# EAGLE schematic MainBoard_V1.2 (EAGLE 7.1.0)
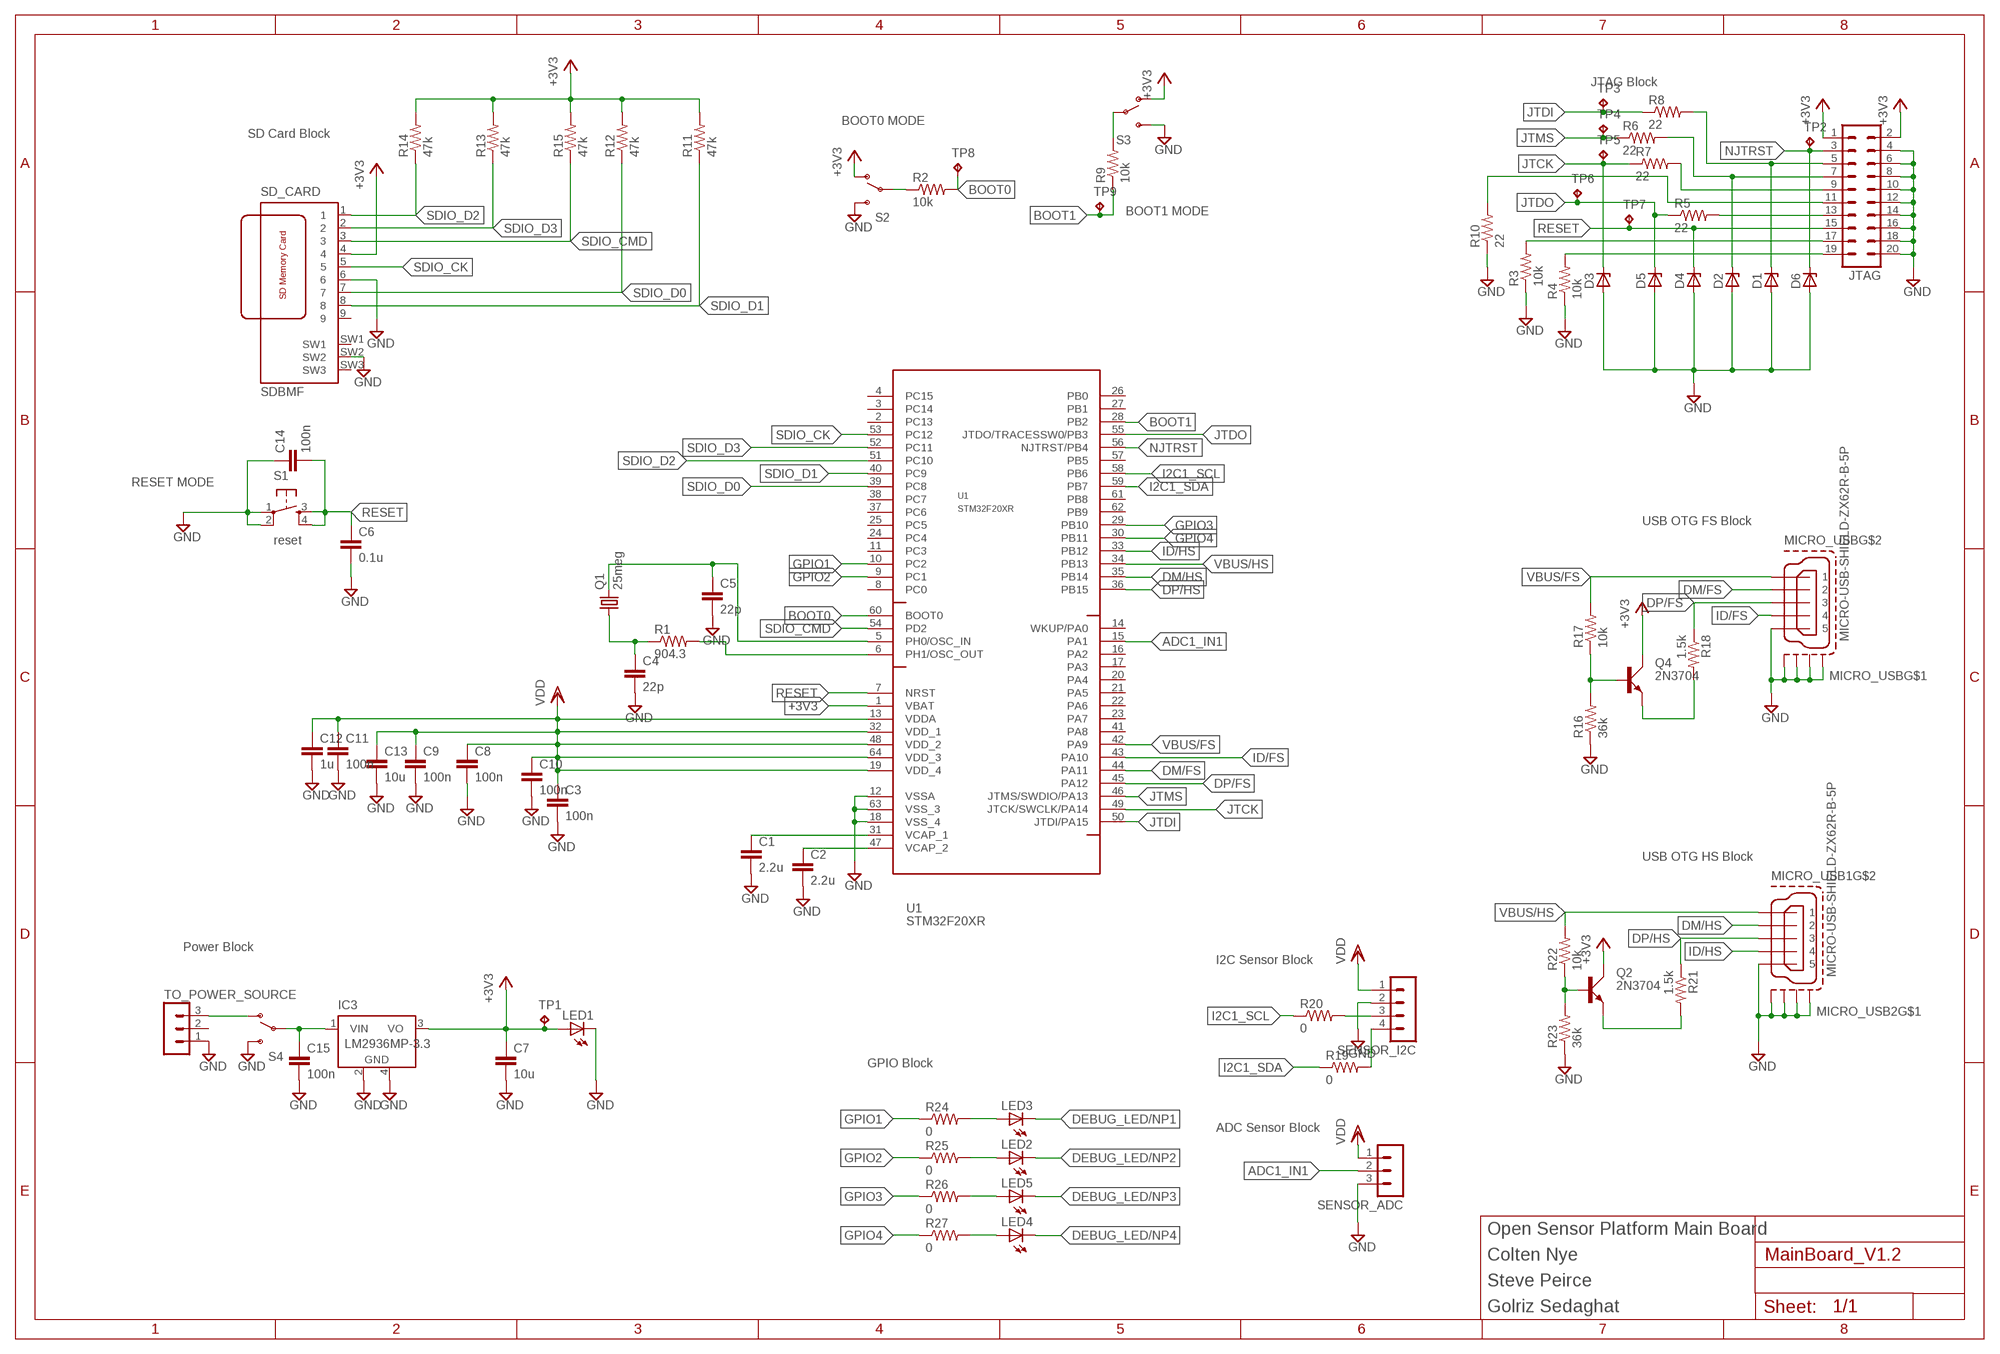
[diagram p0: schematic, sheet 1]

## Parts
C1  2.2u  C-EUC0805  [C0805]
C2  2.2u  C-EUC0805  [C0805]
C3  100n  C-EUC0805  [C0805]
C4  22p  C-EUC0805  [C0805]
C5  22p  C-EUC0805  [C0805]
C6  0.1u  C-EUC0805  [C0805]
C7  10u  C-EUC0805  [C0805]
C8  100n  C-EUC0805  [C0805]
C9  100n  C-EUC0805  [C0805]
C10  100n  C-EUC0805  [C0805]
C11  100n  C-EUC0805  [C0805]
C12  1u  C-EUC0805  [C0805]
C13  10u  C-EUC0805  [C0805]
C14  100n  C-EUC0805  [C0805]
C15  100n  C-EUC0805  [C0805]
D1  ZENER-DIODEZD-5  [ZDIO-5]
D2  ZENER-DIODEZD-5  [ZDIO-5]
D3  ZENER-DIODEZD-5  [ZDIO-5]
D4  ZENER-DIODEZD-5  [ZDIO-5]
D5  ZENER-DIODEZD-5  [ZDIO-5]
D6  ZENER-DIODEZD-5  [ZDIO-5]
IC3  LM2936MP-3.3  [SOT223]
JTAG  MA10-2  [MA10-2]
LED1  LEDSML0805  [SML0805]
LED2  LEDSML0805  [SML0805]
LED3  LEDSML0805  [SML0805]
LED4  LEDSML0805  [SML0805]
LED5  LEDSML0805  [SML0805]
MICRO_USB  MICRO-USB-SHIELD-ZX62R-B-5P  [ZX62R-B-5P]
MICRO_USB1  MICRO-USB-SHIELD-ZX62R-B-5P  [ZX62R-B-5P]
MICRO_USB2  MICRO-USB-SHIELD-ZX62R-B-5P  [ZX62R-B-5P]
Q1  25meg  CRYSTALHC49S  [HC49/S]
Q2  2N3704  [TO92C]
Q4  2N3704  [TO92C]
R1  904.3  R-US_R0805  [R0805]
R2  10k  R-US_R0805  [R0805]
R3  10k  R-US_R0805  [R0805]
R4  10k  R-US_R0805  [R0805]
R5  22  R-US_R0805  [R0805]
R6  22  R-US_R0805  [R0805]
R7  22  R-US_R0805  [R0805]
R8  22  R-US_R0805  [R0805]
R9  10k  R-US_R0805  [R0805]
R10  22  R-US_R0805  [R0805]
R11  47k  R-US_R0805  [R0805]
R12  47k  R-US_R0805  [R0805]
R13  47k  R-US_R0805  [R0805]
R14  47k  R-US_R0805  [R0805]
R15  47k  R-US_R0805  [R0805]
R16  36k  R-US_R0805  [R0805]
R17  10k  R-US_R0805  [R0805]
R18  1.5k  R-US_R0805  [R0805]
R19  0  R-US_R0805  [R0805]
R20  0  R-US_R0805  [R0805]
R21  1.5k  R-US_R0805  [R0805]
R22  10k  R-US_R0805  [R0805]
R23  36k  R-US_R0805  [R0805]
R24  0  R-US_R0805  [R0805]
R25  0  R-US_R0805  [R0805]
R26  0  R-US_R0805  [R0805]
R27  0  R-US_R0805  [R0805]
S1  reset  TAC_SWITCHSMD  [TACTILE-SWITCH-SMD]
S2  SWITCH-SPDT-SMD-A  [SWITCH-SPST-SMD-A]
S3  SWITCH-SPDT-SMD-A  [SWITCH-SPST-SMD-A]
S4  SWITCH-SPDT-SMD-A  [SWITCH-SPST-SMD-A]
SD_CARD  SDBMF  [SDBMF-009XXBXX2]
SENSOR_ADC  MA03-1  [MA03-1]
SENSOR_I2C  MA04-1  [MA04-1]
TO_POWER_SOURCE  MA03-1  [MA03-1]
TP1  TPB1,27  [B1,27]
TP2  TPB1,27  [B1,27]
TP3  TPB1,27  [B1,27]
TP4  TPB1,27  [B1,27]
TP5  TPB1,27  [B1,27]
TP6  TPB1,27  [B1,27]
TP7  TPB1,27  [B1,27]
TP8  TPB1,27  [B1,27]
TP9  TPB1,27  [B1,27]
U1  STM32F20XR  [LQFP64]

## Nets
+3V1: C15.1 IC3.1(VIN) S4.2(P)
+3V3: C7.1 IC3.3(VO) JTAG.1 JTAG.2 LED1.A Q2.C Q4.C R11.2 R12.2 R13.2 R14.2 R15.2 S2.1(O) S3.1(O) SD_CARD.4 TP1.TP U1.1(VBAT)
ADC1_IN1: SENSOR_ADC.2 U1.15(PA1)
BOOT0: R2.2 TP8.TP U1.60(BOOT0)
BOOT1: R9.1 TP9.TP U1.28(PB2)
DEBUG_LED/NP1: LED3.C
DEBUG_LED/NP2: LED2.C
DEBUG_LED/NP3: LED5.C
DEBUG_LED/NP4: LED4.C
DM/FS: MICRO_USB.2 U1.44(PA11)
DM/HS: MICRO_USB1.2 U1.35(PB14)
DP/FS: MICRO_USB.3 R18.1 U1.45(PA12)
DP/HS: MICRO_USB1.3 R21.1 U1.36(PB15)
GND: C1.2 C2.2 C3.2 C4.2 C5.2 C6.2 C7.2 C8.2 C9.2 C10.2 C11.2 C12.2 C13.2 C14.1 C15.2 D1.A D2.A D3.A D4.A D5.A D6.A IC3.2(GND) IC3.4(GND) JTAG.4 JTAG.6 JTAG.8 JTAG.10 JTAG.12 JTAG.14 JTAG.16 JTAG.18 JTAG.20 LED1.C MICRO_USB1.5 MICRO_USB2.M1(S1) MICRO_USB2.M2(S2) MICRO_USB2.M3(S3) MICRO_USB2.M4(S4) MICRO_USB.5 MICRO_USB.M1(S1) MICRO_USB.M2(S2) MICRO_USB.M3(S3) MICRO_USB.M4(S4) R3.1 R4.1 R10.1 R16.1 R23.1 S1.1 S1.2 S2.3(S) S3.3(S) S4.3(S) SD_CARD.6 SD_CARD.SW2 SENSOR_ADC.3 SENSOR_I2C.2 TO_POWER_SOURCE.1 U1.12(VSSA) U1.18(VSS_4) U1.63(VSS_3)
GPIO1: R24.1 U1.10(PC2)
GPIO2: R25.1 U1.9(PC1)
GPIO3: R26.1 U1.29(PB10)
GPIO4: R27.1 U1.30(PB11)
I2C1_SCL: R20.1 U1.58(PB6)
I2C1_SDA: R19.1 U1.59(PB7)
ID/FS: MICRO_USB.4 U1.43(PA10)
ID/HS: MICRO_USB1.4 U1.33(PB12)
JTCK: D3.C R7.1 TP5.TP U1.49(JTCK/SWCLK/PA14)
JTDI: R8.1 TP3.TP U1.50(JTDI/PA15)
JTDO: D5.C R5.1 TP6.TP U1.55(JTDO/TRACESSW0/PB3)
JTMS: R6.1 TP4.TP U1.46(JTMS/SWDIO/PA13)
N$1: C1.1 U1.31(VCAP_1)
N$2: C2.1 U1.47(VCAP_2)
N$3: JTAG.9 R7.2
N$4: S4.1(O) TO_POWER_SOURCE.3
N$5: C4.1 Q1.1 R1.1
N$6: R2.1 S2.2(P)
N$7: JTAG.11 R10.2
N$8: Q4.E R18.2
N$9: R1.2 U1.6(PH1/OSC_OUT)
N$10: JTAG.19 R4.2
N$11: Q2.E R21.2
N$12: JTAG.17 R3.2
N$13: JTAG.13 R5.2
N$15: Q2.B R22.1 R23.2
N$16: D2.C JTAG.7 R6.2
N$18: D1.C JTAG.5 R8.2
N$19: R9.2 S3.2(P)
N$20: LED3.A R24.2
N$21: LED2.A R25.2
N$24: LED5.A R26.2
N$25: LED4.A R27.2
N$33: Q4.B R16.2 R17.1
NJTRST: D6.C JTAG.3 TP2.TP U1.56(NJTRST/PB4)
OSC_IN: C5.1 Q1.2 U1.5(PH0/OSC_IN)
RESET: C6.1 C14.2 D4.C JTAG.15 S1.3 S1.4 TP7.TP U1.7(NRST)
SCL: R20.2 SENSOR_I2C.3
SDA: R19.2 SENSOR_I2C.4
SDIO_CK: SD_CARD.5 U1.53(PC12)
SDIO_CMD: R15.1 SD_CARD.3 U1.54(PD2)
SDIO_D0: R12.1 SD_CARD.7 U1.39(PC8)
SDIO_D1: R11.1 SD_CARD.8 U1.40(PC9)
SDIO_D2: R14.1 SD_CARD.1 U1.51(PC10)
SDIO_D3: R13.1 SD_CARD.2 U1.52(PC11)
VBUS/FS: MICRO_USB.1 R17.2 U1.42(PA9)
VBUS/HS: MICRO_USB1.1 R22.2 U1.34(PB13)
VDD: C3.1 C8.1 C9.1 C10.1 C11.1 C12.1 C13.1 SENSOR_ADC.1 SENSOR_I2C.1 U1.13(VDDA) U1.19(VDD_4) U1.32(VDD_1) U1.48(VDD_2) U1.64(VDD_3)
Unconnected: MICRO_USB1.M1(S1) MICRO_USB1.M2(S2) MICRO_USB1.M3(S3) MICRO_USB1.M4(S4) MICRO_USB2.1 MICRO_USB2.2 MICRO_USB2.3 MICRO_USB2.4 MICRO_USB2.5 SD_CARD.9 SD_CARD.SW1 SD_CARD.SW3 TO_POWER_SOURCE.2 U1.2(PC13) U1.3(PC14) U1.4(PC15) U1.8(PC0) U1.11(PC3) U1.14(WKUP/PA0) U1.16(PA2) U1.17(PA3) U1.20(PA4) U1.21(PA5) U1.22(PA6) U1.23(PA7) U1.24(PC4) U1.25(PC5) U1.26(PB0) U1.27(PB1) U1.37(PC6) U1.38(PC7) U1.41(PA8) U1.57(PB5) U1.61(PB8) U1.62(PB9)

## Notes on the sheet
- JTAG Block
- BOOT0 MODE
- SD Card Block
- BOOT1 MODE
- RESET MODE
- USB OTG FS Block
- USB OTG HS Block
- Power Block
- I2C Sensor Block
- GPIO Block
- ADC Sensor Block
- Open Sensor Platform Main Board
- Colten Nye
- Steve Peirce
- Golriz Sedaghat

## Library data of the parts
C1-C15 = rcl:C-EU: CAPACITOR, European symbol
D1-D6 = diode:ZENER-DIODE: Z-Diode
IC3 = national-semiconductor:LM2936MP?*: Ultra-Low Quiescent Current LDO Voltage Regulator Source: Data sheet <http://www.national.com/ds/LM/LM2936.pdf>; MF: NATIONAL SEMICONDUCTOR; MPN: LM2936MP-3.3/NOPB; OC_FARNELL: 1469062; OC_NEWARK: 41K4523
JTAG = con-lstb:MA10-2: PIN HEADER; OC_FARNELL: unknown; OC_NEWARK: unknown
LED1-LED5 = led:LED: LED OSRAM: - CHIPLED LG R971, LG N971, LY N971, LG Q971, LY Q971, LO R971, LY R971 LH N974, LH R974 LS Q976, LO Q976, LY Q976 LO Q996 - Hyper CHIPLED LW Q18S LB Q993, LB Q99A, LB R99A - SideLED LS A670, LO A670, LY A670, LG A670, LP A670 LB A673, LV A673, LT A673, LW A673 LH A674 LY A675 LS A676, LA A676, LO A676, LY A676, LW A676 LS A679, LY A679, LG A679 - Hyper Micro SIDELED® LS Y876, LA Y876, LO Y876, LY Y876 LT Y87S - SmartLED LW L88C, LW L88S LB L89C, LB L89S, LG L890 LS L89K, LO L89K, LY L89K LS L896, LA L896, LO L896, LY L896 - TOPLED LS T670, LO T670, LY T670, LG T670, LP T670 LSG T670, LSP T670, LSY T670, LOP T670, LYG T670 LG T671, LOG T671, LSG T671 LB T673, LV T673, LT T673, LW T673 LH T674 LS T676, LA T676, LO T676, LY T676, LB T676, LH T676, LSB T676, LW T676 LB T67C, LV T67C, LT T67C, LS T67K, LO T67K, LY T67K, LW E67C LS E67B, LA E67B, LO E67B, LY E67B, LB E67C, LV E67C, LT E67C LW T67C LS T679, LY T679, LG T679 LS T770, LO T770, LY T770, LG T770, LP T770 LB T773, LV T773, LT T773, LW T773 LH T774 LS E675, LA E675, LY E675, LS T675 LS T776, LA T776, LO T776, LY T776, LB T776 LHGB T686 LT T68C, LB T68C - Hyper Mini TOPLED® LB M676 - Mini TOPLED Santana® LG M470 LS M47K, LO M47K, LY M47K Source: http://www.osram.convergy.de LUXEON: - LUMILED® LXK2-PW12-R00, LXK2-PW12-S00, LXK2-PW14-U00, LXK2-PW14-V00 LXK2-PM12-R00, LXK2-PM12-S00, LXK2-PM14-U00 LXK2-PE12-Q00, LXK2-PE12-R00, LXK2-PE12-S00, LXK2-PE14-T00, LXK2-PE14-U00 LXK2-PB12-K00, LXK2-PB12-L00, LXK2-PB12-M00, LXK2-PB14-N00, LXK2-PB14-P00, LXK2-PB14-Q00 LXK2-PR12-L00, LXK2-PR12-M00, LXK2-PR14-Q00, LXK2-PR14-R00 LXK2-PD12-Q00, LXK2-PD12-R00, LXK2-PD12-S00 LXK2-PH12-R00, LXK2-PH12-S00 LXK2-PL12-P00, LXK2-PL12-Q00, LXK2-PL12-R00 Source: www.luxeon.com KINGBRIGHT: KA-3528ASYC Source: www.kingbright.com
MICRO_USB MICRO_USB1 MICRO_USB2 = con-hirose:MICRO-USB-SHIELD-: Hirose Micro USB Connector ZX62R-B-5P: Micro B, reverse (top mount) shell SMT Supplier: DigiKey H11574CT-ND Source: http://www.hirose.co.jp/cataloge_hp/e24200011.pdf
Q1 = crystal:CRYSTAL: CRYSTAL; OC_FARNELL: 1667008; OC_NEWARK: unknown
Q2 Q4 = transistor-small-signal:2N3704: NPN TRANSISTOR
R1-R27 = rcl:R-US_: RESISTOR, American symbol
S1 = SparkFun-Electromechanical:TAC_SWITCH: Momentary Switch Button commonly used for reset or general input. Spark Fun Electronics SKU : COM-00097 SMT- SWCH-08247; PROD_ID: SWCH-08247; VALUE: TAC_SWITCHSMD
S2-S4 = SparkFun-Electromechanical:SWITCH-SPDT: SPDT Switch Simple slide switch, Spark Fun Electronics SKU : COM-00102 DPDT SMT slide switch, AYZ0202, SWCH-08179
SD_CARD = farnell:SDBMF: SD MEMORY CARD PUSH-PUSH WITH CONNECTOR TYPE B (BIG SWUÌTCH #3) KINGFONT PRECISION INDUSTIAL CO., LTD Source: http://www.farnell.com/datasheets/74273.pdf Best.-Nr.: 9186174 Hersteller: MULTICOMP Herstellerbez.: SDBMF-00915B0T2
SENSOR_ADC TO_POWER_SOURCE = con-lstb:MA03-1: PIN HEADER; OC_FARNELL: unknown; OC_NEWARK: unknown
SENSOR_I2C = con-lstb:MA04-1: PIN HEADER; OC_FARNELL: unknown; OC_NEWARK: unknown
TP1-TP9 = testpad:TP: Test pad
U1 = stm32F:STM32F20XR